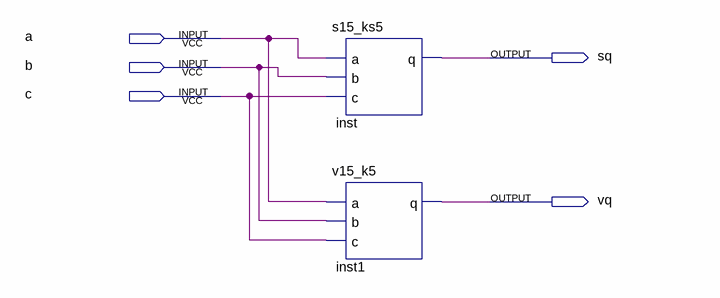
[diagram p0: schematic sheet]
// Quartus schematic sv15_ks5.bdf as structural Verilog: 2 symbols, 5 pins
module sv15_ks5 (
  input  a,
  input  b,
  input  c,
  output sq,
  output vq
);

  s15_ks5 inst (.a(a), .b(b), .c(c), .q(sq));
  v15_k5 inst1 (.a(a), .b(b), .c(c), .q(vq));
endmodule
